# Altium project ORD_POTS.PrjPcb
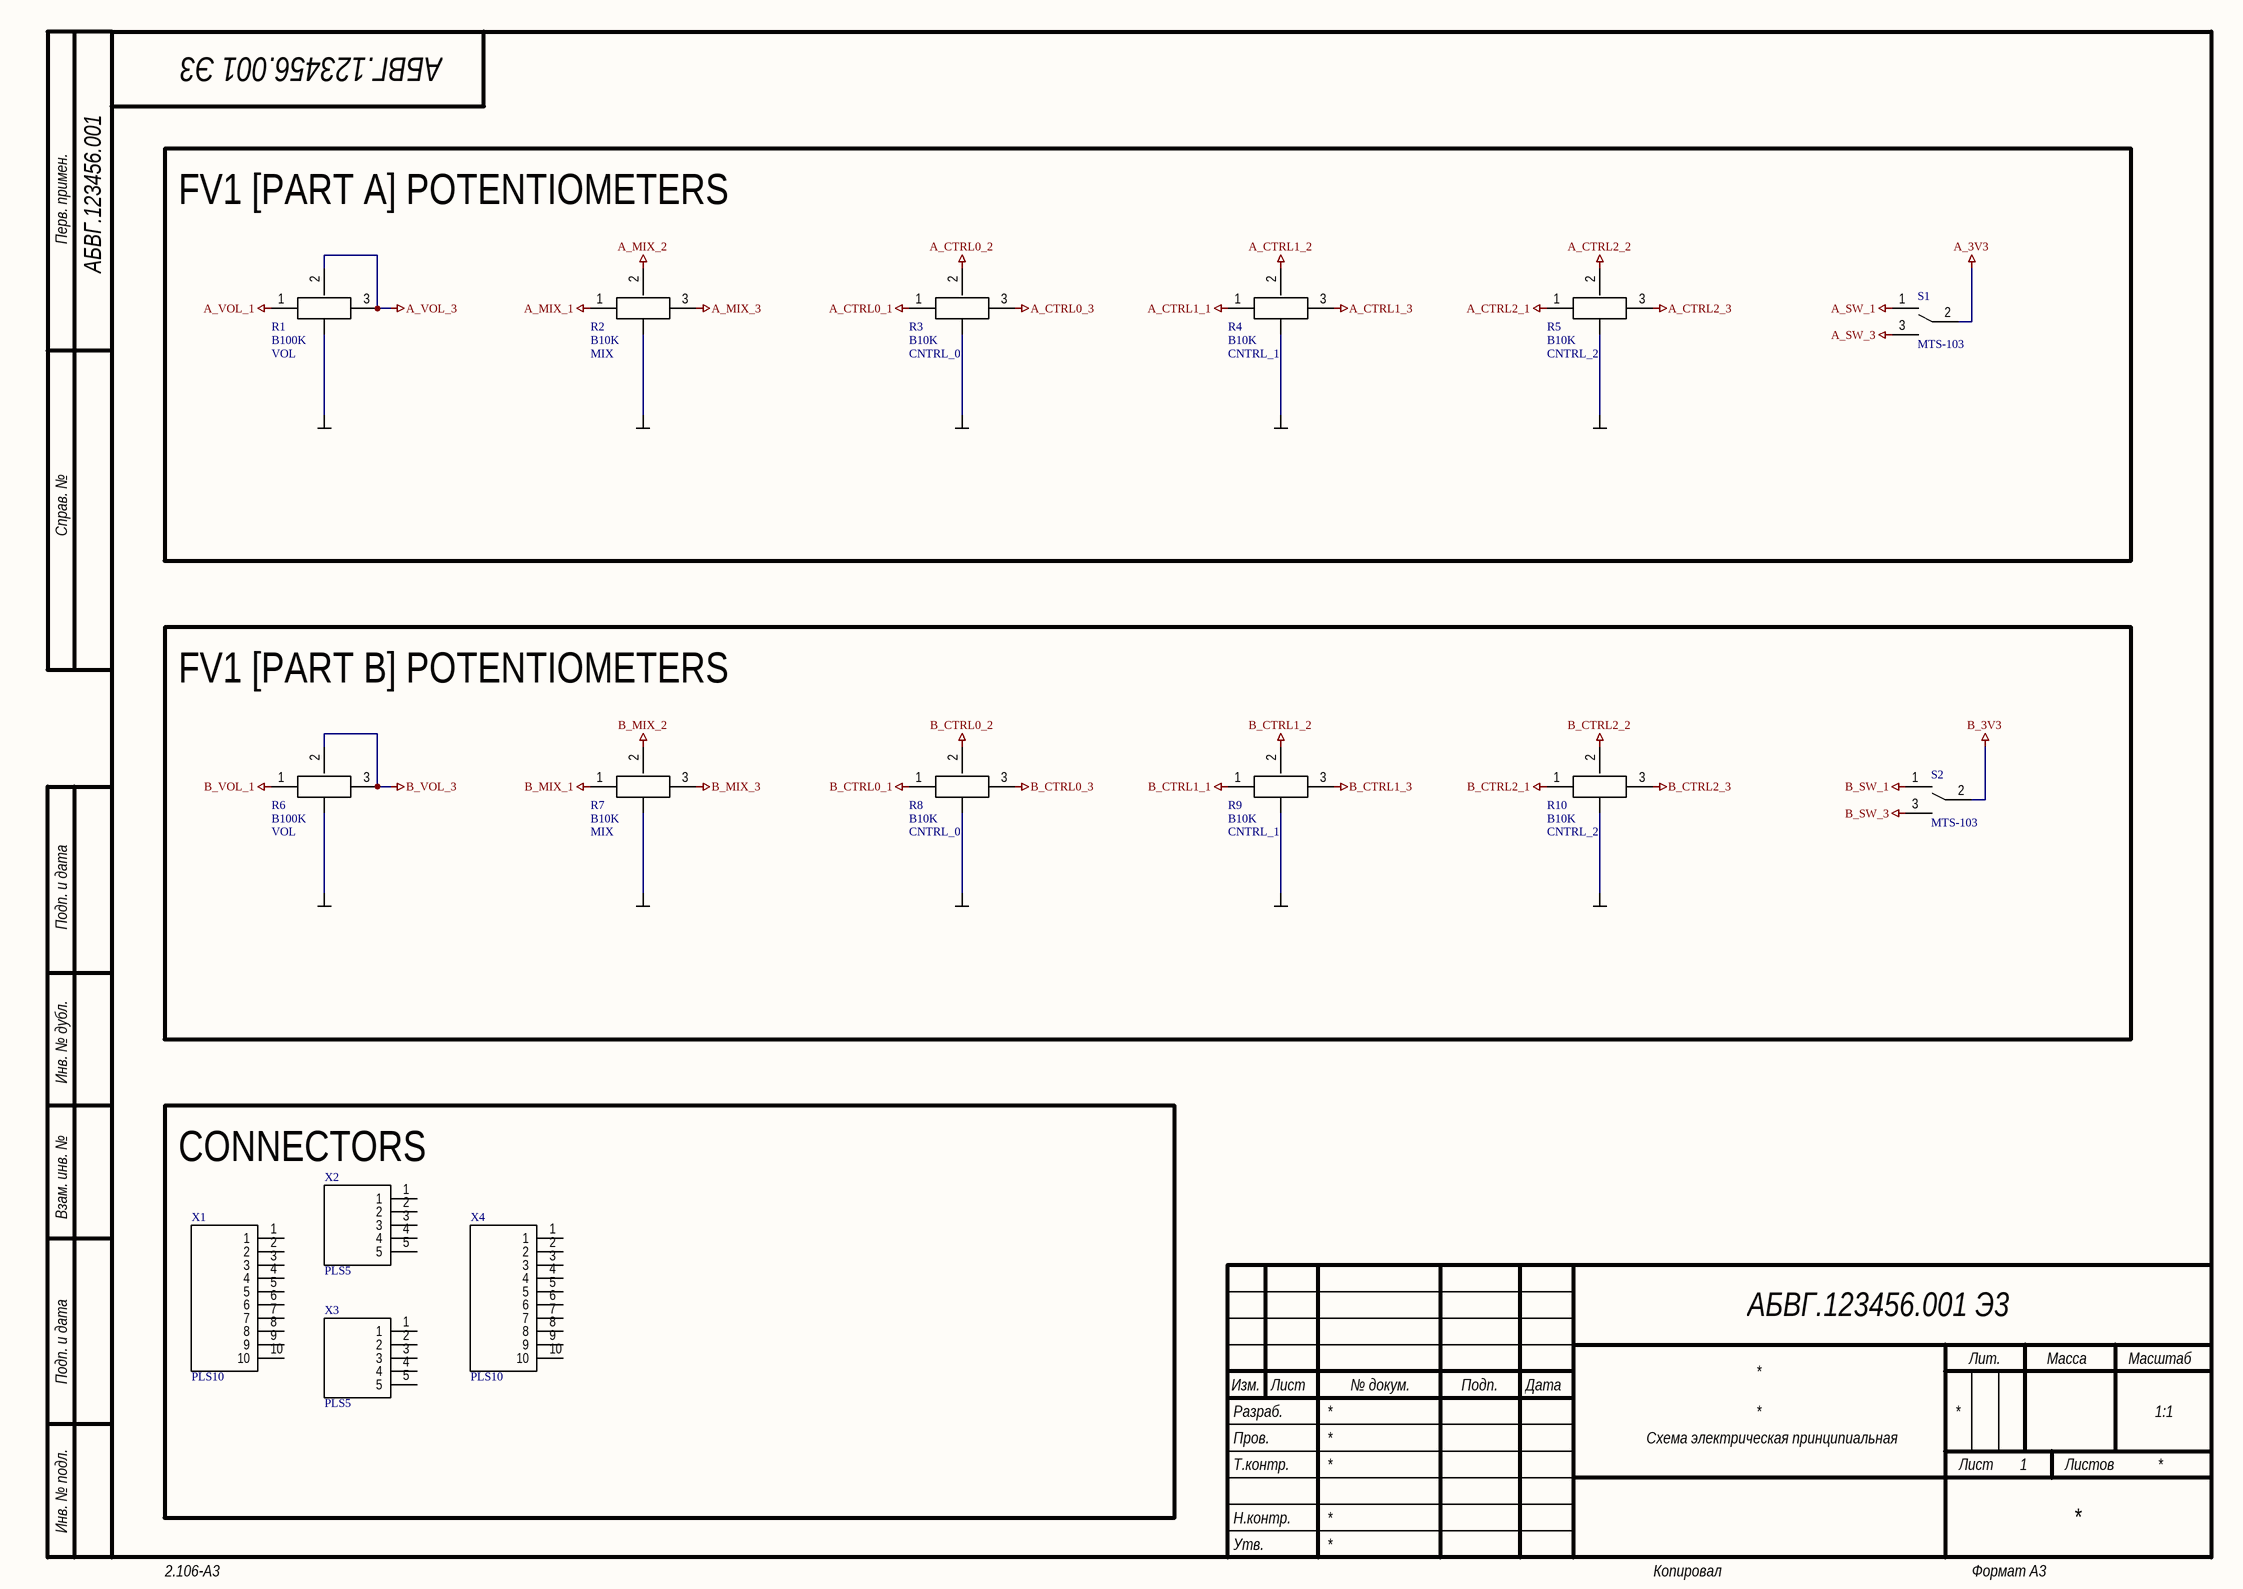
[diagram p0: ORD_POT.SchDoc]
1 sheet, 16 parts. Net scope: global (net labels, ports and power ports of the same name join across sheets).
Board file: ORD_POT_PCB.PcbDoc

## Sheet ORD_POT.SchDoc
size 420 x 297 mm; Address1: Address1; Address2: Address2; Address3: Address3; Address4: Address4; DocumentNumber: АБВГ.123456.001 Э3; SheetNumber: 1; Scale: 1:1; DocumentType: Схема электрическая принципиальная; FirstReferrence: АБВГ.123456.001

### Parts
R1  B100K  [RK097]
R2  B10K  [RK097]
R3  B10K  [RK097]
R4  B10K  [RK097]
R5  B10K  [RK097]
R6  B100K  [RK097]
R7  B10K  [RK097]
R8  B10K  [RK097]
R9  B10K  [RK097]
R10  B10K  [RK097]
S1  MTS-103  [MTS-103]
S2  MTS-103  [MTS-103]
X1  PLS10  [PLS-10]
X2  PLS5  [pls-5]
X3  PLS5  [pls-5]
X4  PLS10  [PLS-10]

### Blocks framed on the sheet
FV1 [PART A] POTENTIOMETERS: R1-R5 S1
FV1 [PART B] POTENTIOMETERS: R6-R10 S2
CONNECTORS: X1-X4

### Nets
A_3V3: S1.2
A_CTRL0_1: R3.1
A_CTRL0_2: R3.2
A_CTRL0_3: R3.3
A_CTRL1_1: R4.1
A_CTRL1_2: R4.2
A_CTRL1_3: R4.3
A_CTRL2_1: R5.1
A_CTRL2_2: R5.2
A_CTRL2_3: R5.3
A_MIX_1: R2.1
A_MIX_2: R2.2
A_MIX_3: R2.3
A_SW_1: S1.1
A_SW_3: S1.3
A_VOL_1: R1.1
A_VOL_3: R1.2 R1.3
B_3V3: S2.2
B_CTRL0_1: R8.1
B_CTRL0_2: R8.2
B_CTRL0_3: R8.3
B_CTRL1_1: R9.1
B_CTRL1_2: R9.2
B_CTRL1_3: R9.3
B_CTRL2_1: R10.1
B_CTRL2_2: R10.2
B_CTRL2_3: R10.3
B_MIX_1: R7.1
B_MIX_2: R7.2
B_MIX_3: R7.3
B_SW_1: S2.1
B_SW_3: S2.3
B_VOL_1: R6.1
B_VOL_3: R6.2 R6.3

Not connected (* = marked no-connect by the designer): R1 4; R2 4; R3 4; R4 4; R5 4; R6 4; R7 4; R8 4; R9 4; R10 4; X1 1 2 3 4 5 6 7 8 9 10; X2 1 2 3 4 5; X3 1 2 3 4 5; X4 1 2 3 4 5 6 7 8 9 10

### Notes on the sheet
- (near R1) VOL
- (near R2) MIX
- (near R3) CNTRL_0
- (near R4) CNTRL_1
- (near R5) CNTRL_2
- (near R6) VOL
- (near R7) MIX
- (near R8) CNTRL_0
- (near R9) CNTRL_1
- (near R10) CNTRL_2
- Перв. примен.
- Справ. №
- Подп. и дата
- Инв. № дубл.
- Взам. инв. №
- Разраб.
- Изм.
- Лист
- № докум.
- Подп.
- Дата
- Лит.
- Масса
- Масштаб
- Пров.
- Т.контр.
- Листов
- Инв. № подл.
- Утв.
- Н.контр.
- 2.106-A3
- Копировал
- Формат А3

### Library data of the parts
R1-R10 = RK097: Value: *; Function: *
S1 S2 = MTS-103: Switch, ON-OFF-ON
X1 X4 = PLS10: 2.54 mm; System: Connector
X2 X3 = PLS5: 2.54 mm; System: Connector